# EAGLE schematic nRF52840_qfaa_var5 (EAGLE 9.1.3)
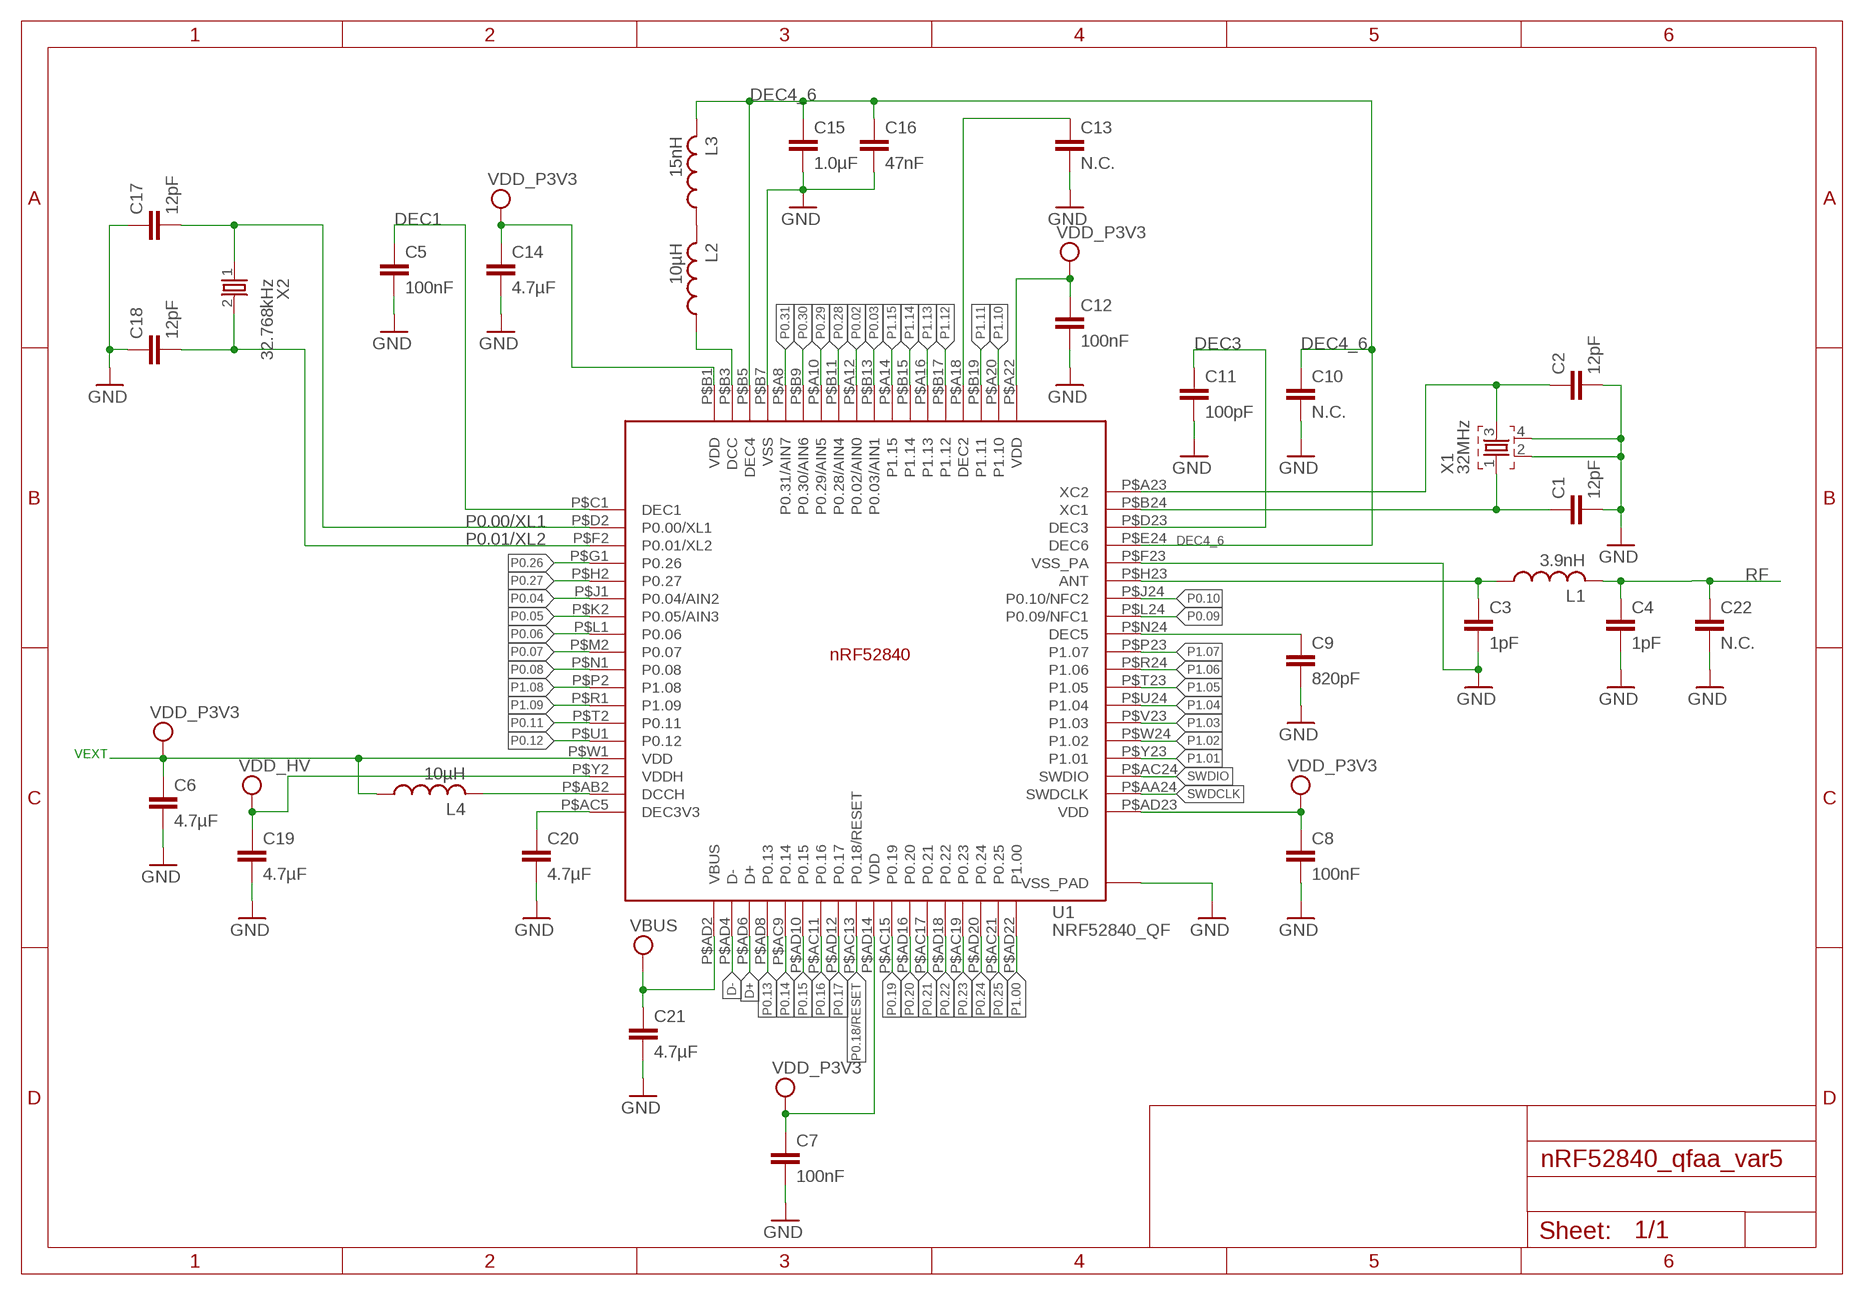
[diagram p0: schematic, sheet 1]

## Parts
C1  12pF  CAPACITOR_0402_N  [RESC0402_N]
C2  12pF  CAPACITOR_0402_N  [RESC0402_N]
C3  1pF  CAPACITOR_0402_N  [RESC0402_N]
C4  1pF  CAPACITOR_0402_N  [RESC0402_N]
C5  100nF  CAPACITOR_0402_N  [RESC0402_N]
C6  4.7µF  CAPACITOR_0603_N  [RESC0603_N]
C7  100nF  CAPACITOR_0402_N  [RESC0402_N]
C8  100nF  CAPACITOR_0402_N  [RESC0402_N]
C9  820pF  CAPACITOR_0402_N  [RESC0402_N]
C10  N.C.  CAPACITOR_0402_N  [RESC0402_N]
C11  100pF  CAPACITOR_0402_N  [RESC0402_N]
C12  100nF  CAPACITOR_0402_N  [RESC0402_N]
C13  N.C.  CAPACITOR_0402_N  [RESC0402_N]
C14  4.7µF  CAPACITOR_0603_N  [RESC0603_N]
C15  1.0µF  CAPACITOR_0603_N  [RESC0603_N]
C16  47nF  CAPACITOR_0402_N  [RESC0402_N]
C17  12pF  CAPACITOR_0402_N  [RESC0402_N]
C18  12pF  CAPACITOR_0402_N  [RESC0402_N]
C19  4.7µF  CAPACITOR_0603_N  [RESC0603_N]
C20  4.7µF  CAPACITOR_0603_N  [RESC0603_N]
C21  4.7µF  CAPACITOR_0603_N  [RESC0603_N]
C22  N.C.  CAPACITOR_0402_N  [RESC0402_N]
L1  3.9nH  INDUCTOR_0402_N  [RESC0402_N]
L2  10µH  INDUCTOR_0603_N  [RESC0603_N]
L3  15nH  INDUCTOR_0402_N  [RESC0402_N]
L4  10µH  INDUCTOR_0603_N  [RESC0603_N]
U1  NRF52840_QF  [AQFN50P700X700X85_HS-74N]
X1  32MHz  XTAL_32MHZ  [BT-XTAL_2016_N]
X2  32.768kHz  XTAL_32KHZ  [XTAL_3215_N]

## Nets
ANT: C3.1 L1.1 U1.P$H23(ANT)
D+: U1.P$AD6(D+)
D-: U1.P$AD4(D-)
DCC: L2.1 U1.P$B3(DCC)
DEC1: C5.1 U1.P$C1(DEC1)
DEC2: C13.1 U1.P$A18(DEC2)
DEC3: C11.1 U1.P$D23(DEC3)
DEC3V3: C20.1 U1.P$AC5(DEC3V3)
DEC4_6: C10.1 C15.1 C16.1 L3.2 U1.P$B5(DEC4) U1.P$E24(DEC6)
DEC5: C9.1 U1.P$N24(DEC5)
GND: C1.2 C2.2 C3.2 C4.2 C5.2 C6.2 C7.2 C8.2 C9.2 C10.2 C11.2 C12.2 C13.2 C14.2 C15.2 C16.2 C17.1 C18.1 C19.2 C20.2 C21.2 C22.2 U1.P$74(VSS_PAD) U1.P$75(VSS_PAD) U1.P$76(VSS_PAD) U1.P$77(VSS_PAD) U1.P$78(VSS_PAD) U1.P$79(VSS_PAD) U1.P$80(VSS_PAD) U1.P$81(VSS_PAD) U1.P$82(VSS_PAD) U1.P$83(VSS_PAD) U1.P$84(VSS_PAD) U1.P$85(VSS_PAD) U1.P$86(VSS_PAD) U1.P$87(VSS_PAD) U1.P$88(VSS_PAD) U1.P$89(VSS_PAD) U1.P$90(VSS_PAD) U1.P$B7(VSS) U1.P$F23(VSS_PA) X1.2 X1.4
N$1: L4.2 U1.P$AB2(DCCH)
N$2: L2.2 L3.1
P0.00/XL1: C17.2 U1.P$D2(P0.00/XL1) X2.1
P0.01/XL2: C18.2 U1.P$F2(P0.01/XL2) X2.2
P0.02: U1.P$A12(P0.02/AIN0)
P0.03: U1.P$B13(P0.03/AIN1)
P0.04: U1.P$J1(P0.04/AIN2)
P0.05: U1.P$K2(P0.05/AIN3)
P0.06: U1.P$L1(P0.06)
P0.07: U1.P$M2(P0.07)
P0.08: U1.P$N1(P0.08)
P0.09: U1.P$L24(P0.09/NFC1)
P0.10: U1.P$J24(P0.10/NFC2)
P0.11: U1.P$T2(P0.11)
P0.12: U1.P$U1(P0.12)
P0.13: U1.P$AD8(P0.13)
P0.14: U1.P$AC9(P0.14)
P0.15: U1.P$AD10(P0.15)
P0.16: U1.P$AC11(P0.16)
P0.17: U1.P$AD12(P0.17)
P0.18/RESET: U1.P$AC13(P0.18/RESET)
P0.19: U1.P$AC15(P0.19)
P0.20: U1.P$AD16(P0.20)
P0.21: U1.P$AC17(P0.21)
P0.22: U1.P$AD18(P0.22)
P0.23: U1.P$AC19(P0.23)
P0.24: U1.P$AD20(P0.24)
P0.25: U1.P$AC21(P0.25)
P0.26: U1.P$G1(P0.26)
P0.27: U1.P$H2(P0.27)
P0.28: U1.P$B11(P0.28/AIN4)
P0.29: U1.P$A10(P0.29/AIN5)
P0.30: U1.P$B9(P0.30/AIN6)
P0.31: U1.P$A8(P0.31/AIN7)
P1.00: U1.P$AD22(P1.00)
P1.01: U1.P$Y23(P1.01)
P1.02: U1.P$W24(P1.02)
P1.03: U1.P$V23(P1.03)
P1.04: U1.P$U24(P1.04)
P1.05: U1.P$T23(P1.05)
P1.06: U1.P$R24(P1.06)
P1.07: U1.P$P23(P1.07)
P1.08: U1.P$P2(P1.08)
P1.09: U1.P$R1(P1.09)
P1.10: U1.P$A20(P1.10)
P1.11: U1.P$B19(P1.11)
P1.12: U1.P$B17(P1.12)
P1.13: U1.P$A16(P1.13)
P1.14: U1.P$B15(P1.14)
P1.15: U1.P$A14(P1.15)
RF: C4.1 C22.1 L1.2
SWDCLK: U1.P$AA24(SWDCLK)
SWDIO: U1.P$AC24(SWDIO)
VBUS: C21.1 U1.P$AD2(VBUS)
VDD_HV: C19.1 U1.P$Y2(VDDH)
VDD_P3V3: C6.1 C7.1 C8.1 C12.1 C14.1 L4.1 U1.P$A22(VDD) U1.P$AD14(VDD) U1.P$AD23(VDD) U1.P$B1(VDD) U1.P$W1(VDD)
XC1: C1.1 U1.P$B24(XC1) X1.1
XC2: C2.1 U1.P$A23(XC2) X1.3

## Notes on the sheet
- VEXT

## Library data of the parts
C1-C22 = Nordic_nRF:CAPACITOR: Generic chip capacitor
L1-L4 = Nordic_nRF:INDUCTOR: Generic chip inductor
U1 = Nordic_nRF:NRF52840_QF: nRF52840 Features Advanced Single chip 2.4 GHz multi-protocol SoC 32-bit ARM Cortex-M4F Processor 1.7v to 5.5v operation 1MB flash + 256kB RAM Bluetooth 5 support for long range and high throughput 802.15.4 radio support On-chip NFC PPI –Programmable Peripheral Interconnect Automated power management system with automatic power management of each peripheral Configurable I/O mapping for analog and digital I/O 48 x GPIO 1 x QSPI 4 x Master/Slave SPI 2 x Two-wire interface (I²C) I²S interface 2 x UART 4 x PWM USB 2.0 controller ARM TrustZone CryptoCell-310 Cryptographic and security module AES 128-bit ECB/CCM/AAR hardware accelerator Digital microphone interface (PDM) Quadrature decoder 12-bit ADC Low power comparator On-chip 50Ω balun On-air compatible with nRF52, nRF51 and nRF24 Series Applications Advanced high performance wearables Wearables for secure payments Virtual Reality/Augmented Reality systems Smart Home sensor networks Smart city sensor networks High performance HID controllers Internet of Things (IoT) sensor networks Smart door locks Smart lighting networks Connected white goods
X1 = Nordic_nRF:XTAL_32MHZ
X2 = Nordic_nRF:XTAL_32KHZ